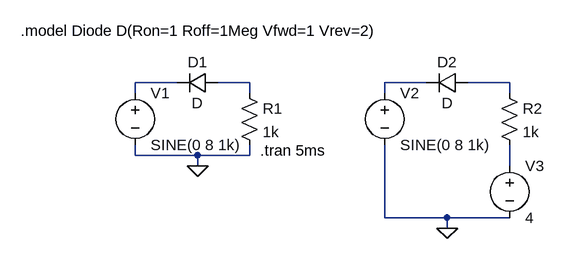
[diagram p0: schematic Pranala Luar - Clipper Circuit Simulation in LTspice.asc]
Pranala Luar - Clipper Circuit Simulation in LTspice.asc, the LTspice schematic file:
Version 4
SHEET 1 880 680
WIRE 32 32 -32 32
WIRE 144 32 96 32
WIRE 416 32 352 32
WIRE 544 32 480 32
WIRE -32 48 -32 32
WIRE 144 48 144 32
WIRE 352 48 352 32
WIRE 544 48 544 32
WIRE -32 144 -32 128
WIRE 64 144 -32 144
WIRE 144 144 144 128
WIRE 144 144 64 144
WIRE 64 160 64 144
WIRE 544 160 544 128
WIRE 352 240 352 128
WIRE 448 240 352 240
WIRE 544 240 448 240
WIRE 448 256 448 240
FLAG 64 160 0
FLAG 448 256 0
SYMBOL diode 96 16 R90
WINDOW 0 0 32 VBottom 2
WINDOW 3 32 32 VTop 2
SYMATTR InstName D1
SYMBOL res 128 32 R0
SYMATTR InstName R1
SYMATTR Value 1k
SYMBOL voltage -32 32 R0
WINDOW 123 0 0 Left 0
WINDOW 39 0 0 Left 0
SYMATTR InstName V1
SYMATTR Value SINE(0 8 1k)
SYMBOL voltage 352 32 R0
WINDOW 123 0 0 Left 0
WINDOW 39 0 0 Left 0
SYMATTR InstName V2
SYMATTR Value SINE(0 8 1k)
SYMBOL diode 480 16 R90
WINDOW 0 0 32 VBottom 2
WINDOW 3 32 32 VTop 2
SYMATTR InstName D2
SYMBOL res 528 32 R0
SYMATTR InstName R2
SYMATTR Value 1k
SYMBOL voltage 544 144 R0
WINDOW 123 0 0 Left 0
WINDOW 39 0 0 Left 0
SYMATTR InstName V3
SYMATTR Value 4
TEXT -208 -48 Left 2 !.model Diode D(Ron=1 Roff=1Meg Vfwd=1 Vrev=2)
TEXT 160 136 Left 2 !.tran 5ms

The netlist it stands for:
* Pranala Luar - Clipper Circuit Simulation in LTspice.asc
D1 N002 N001 D
R1 N002 0 1k
V1 N001 0 SINE(0 8 1k)
V2 N003 0 SINE(0 8 1k)
D2 N004 N003 D
R2 N004 N005 1k
V3 N005 0 4
.model D D
.lib standard.dio
.model Diode D(Ron=1 Roff=1Meg Vfwd=1 Vrev=2)
.tran 5ms
.backanno
.end